# EAGLE design ZaehlerSDM72 RS485_mit Serial.swap-optimiert16102024 (EAGLE 7.5.0)
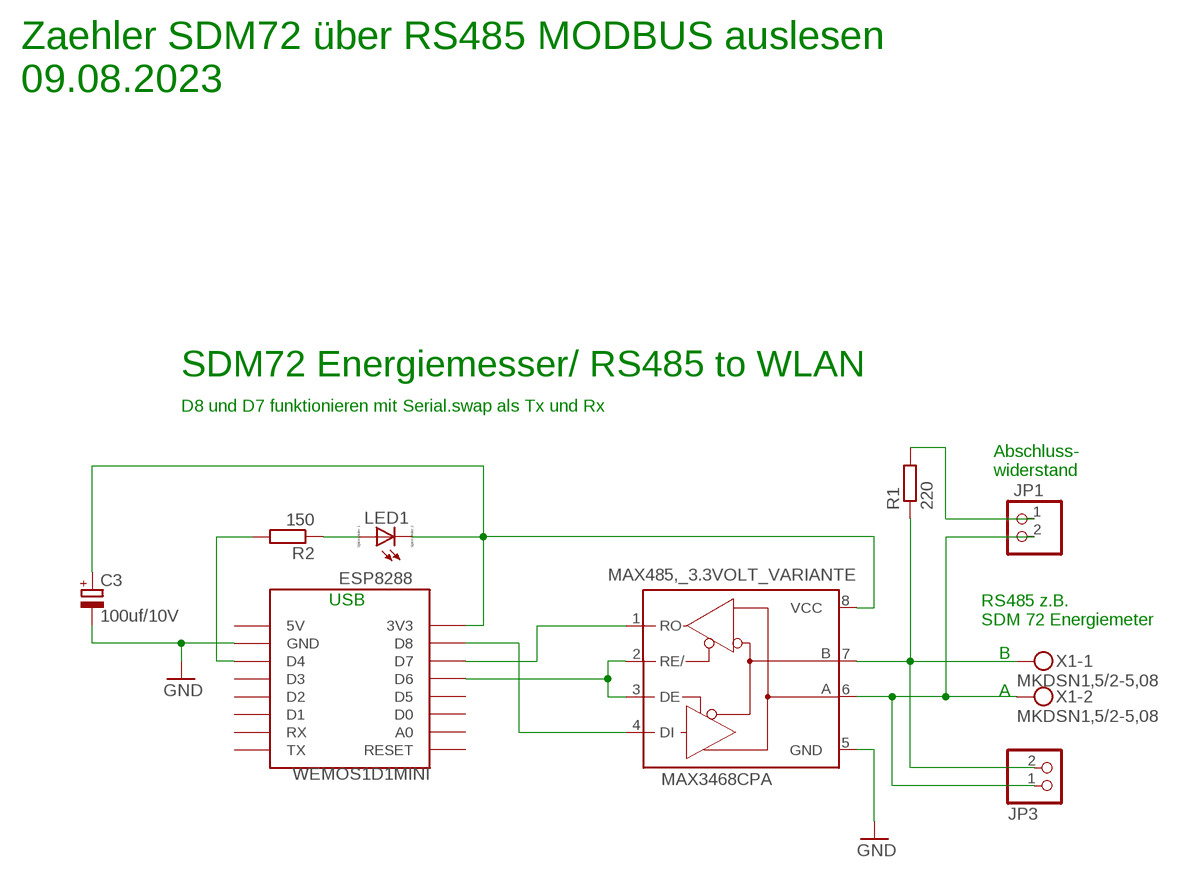
[diagram p0: schematic, sheet 1]

## Parts
C3  100uf/10V  CPOL-EUE2.5-7  [E2,5-7]
JP1  PINHD-1X2/90  [1X02/90]
JP3  PINHD-1X2/90  [1X02/90]
LED1  LED_ELD260  [LED_LD260]
MAX485,_3.3VOLT_VARIANTE  MAX3468CPA  [DIL08]
R1  220  R-EU_0207/5V  [0207/5V]
R2  150  R-EU_0207/5V  [0207/5V]
WEMOS1D1MINI  ESP8288  WEMOS-D1-MINI  [WEMOS-D1-MINI]
X1  MKDSN1,5/2-5,08  [MKDSN1,5/2-5,08]

## Nets
GND: C3.- MAX485,_3.3VOLT_VARIANTE.5(GND) WEMOS1D1MINI.GND
N$1: MAX485,_3.3VOLT_VARIANTE.2(RE/) MAX485,_3.3VOLT_VARIANTE.3(DE) WEMOS1D1MINI.D6
N$2: JP1.1 R1.2
N$3: MAX485,_3.3VOLT_VARIANTE.1(RO) WEMOS1D1MINI.D7
N$4: MAX485,_3.3VOLT_VARIANTE.4(DI) WEMOS1D1MINI.D8
N$5: R2.2 WEMOS1D1MINI.D4
N$6: LED1.A R2.1
N$7: C3.+ LED1.K(C) MAX485,_3.3VOLT_VARIANTE.8(VCC) WEMOS1D1MINI.3V3
N$21: JP3.2 MAX485,_3.3VOLT_VARIANTE.7(B) R1.1 X1.1
N$22: JP1.2 JP3.1 MAX485,_3.3VOLT_VARIANTE.6(A) X1.2
Unconnected: WEMOS1D1MINI.5V WEMOS1D1MINI.A0 WEMOS1D1MINI.D0 WEMOS1D1MINI.D1 WEMOS1D1MINI.D2 WEMOS1D1MINI.D3 WEMOS1D1MINI.D5 WEMOS1D1MINI.RESET WEMOS1D1MINI.RX WEMOS1D1MINI.TX

## Notes on the sheet
- Zaehler SDM72 über RS485 MODBUS auslesen
  09.08.2023
- SDM72 Energiemesser/ RS485 to WLAN
- D8 und D7 funktionieren mit Serial.swap als Tx und Rx
- Abschluss-
  widerstand
- USB
- RS485 z.B. 
  SDM 72 Energiemeter
- B
  
  A

## Library data of the parts
C3 = rcl:CPOL-EU: POLARIZED CAPACITOR, European symbol
JP1 JP3 = pinhead:PINHD-1X2: PIN HEADER
LED1 = eagle-ltspice:LED_E: LED Source: http://www.osram.convergy.de Source: www.luxeon.com Source: www.kingbright.com; SPICEMODEL: NONE; SPICEPREFIX: D; SPICETYPE: diode
MAX485,_3.3VOLT_VARIANTE = maxim:MAX34*: +5V, Fail-Safe, 40Mbps, Profibus RS-485/RS-422 Transceivers Source: MAX3465-MAX3469.pdf; OC_FARNELL: unknown; OC_NEWARK: unknown
R1 R2 = rcl:R-EU_: RESISTOR, European symbol
WEMOS1D1MINI = esp8266modules:WEMOS-D1-MINI: WeMos.cc D1 mini ESP8266 module
X1 = con-phoenix-508:MKDSN1,5/2-5,08: MKDSN 1,5/ 2-5,08 Printklemme Nennstrom: 13,5 A Nennspannung: 250 V Rastermaß: 5,08 mm Polzahl: 2 Anschlussart: Schraubanschluss Montage: Löten Anschlussrichtung Leiter/Platine: 0 ° Artikelnummer: 1729128 Source: http://eshop.phoenixcontact.com .. 1729128.pdf

## Board
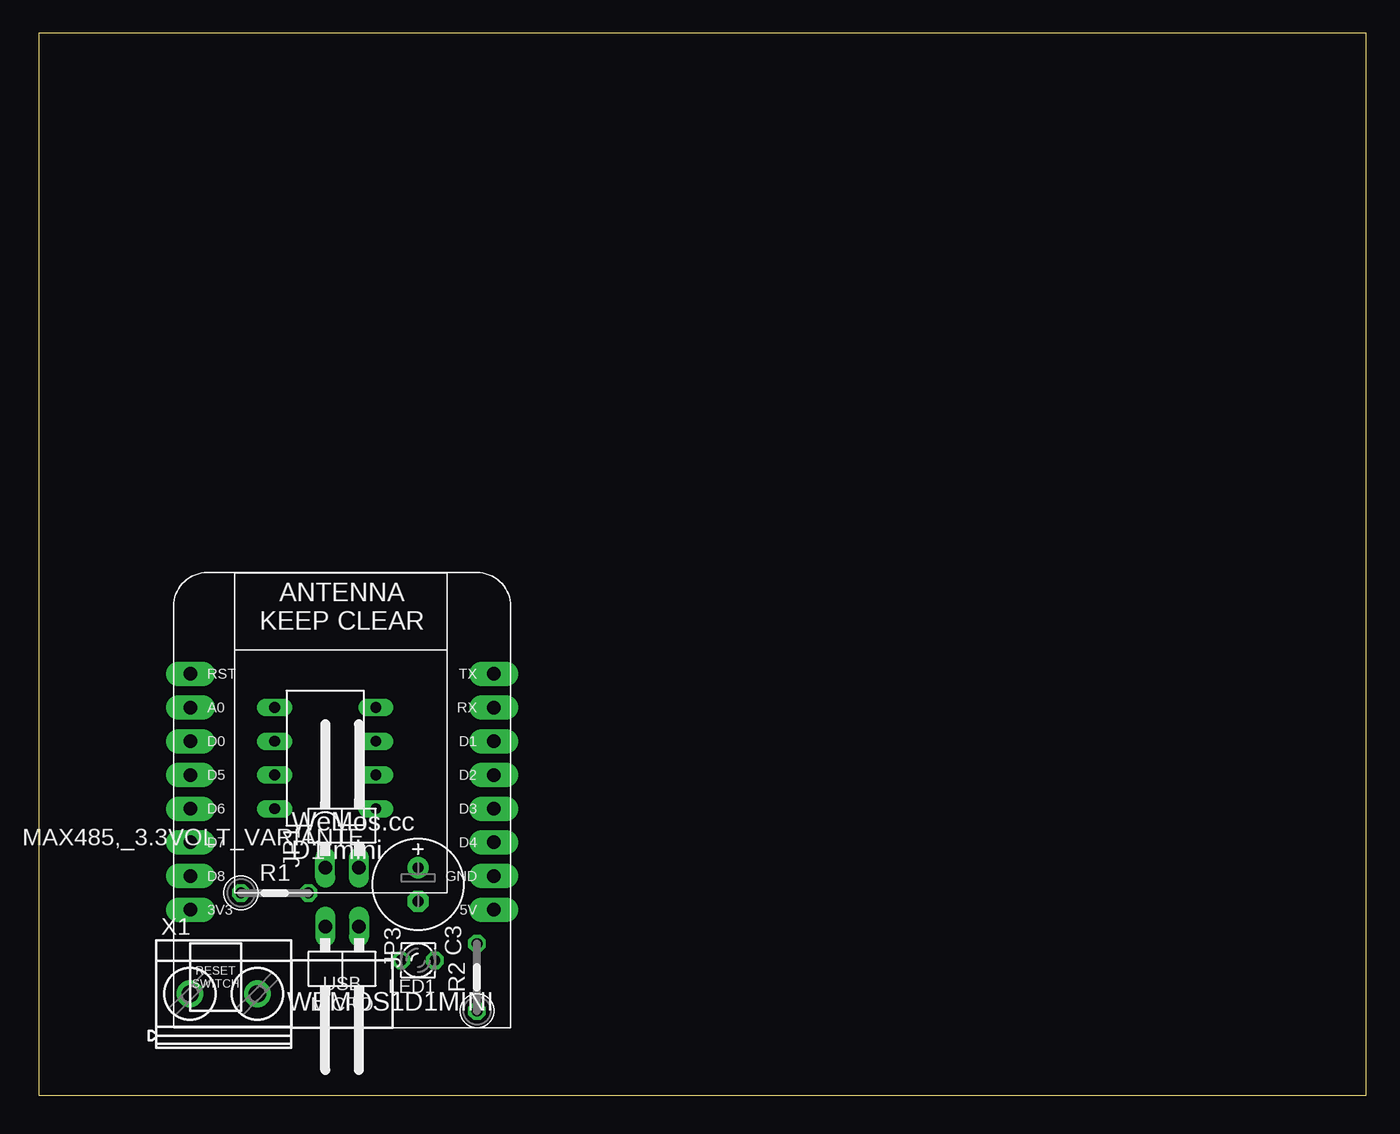
[diagram p1: board, top side]
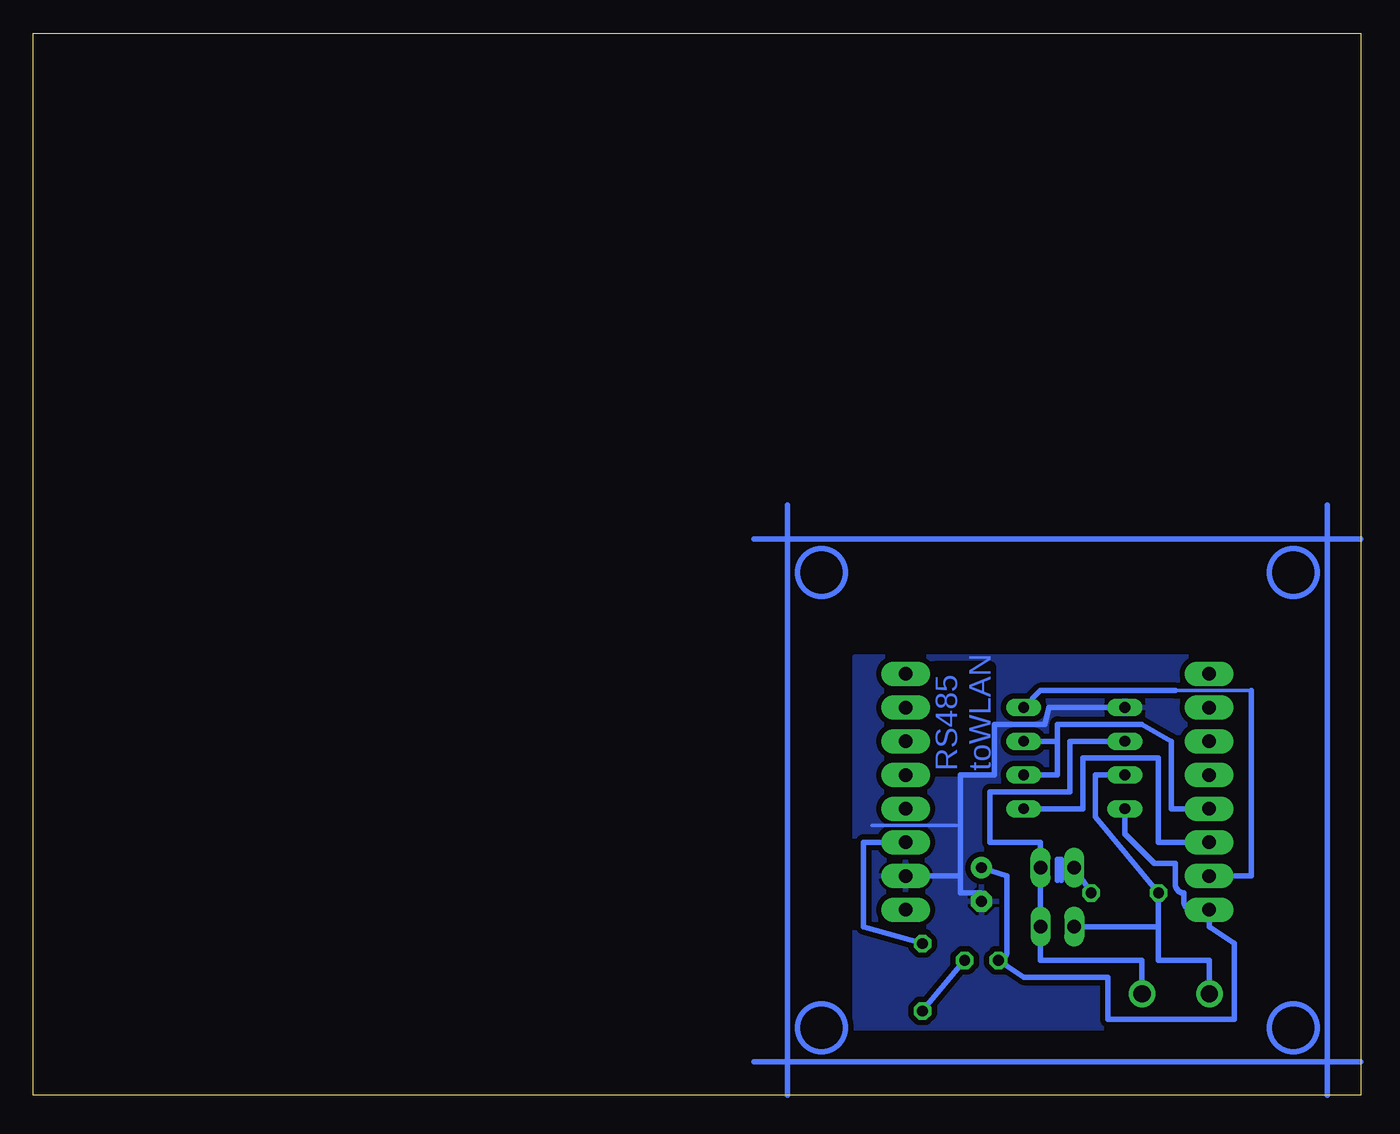
[diagram p2: board, bottom side, seen from below]

Size 100 x 80 mm. Coordinates in mm from the lower left corner, seen from the top.
Outline: 0,0 100,0 100,80 0,80 0,0
Copper layers (1*16): Top 0.035mm / dielectric 1.5mm / Bottom 0.035mm
Design rules "default": minimum track width 10mil, minimum drill 24mil, track to track 8mil, track to pad 8mil, pad to pad 8mil, via to via 8mil, smd to smd 8mil, copper to edge 40mil, drill to drill 8mil, minimum pad ring 10mil, minimum via ring 8mil, stop-mask expansion 4mil, vias tented up to drill 0mil, thermal gap 10mil

### Footprints (pad centres in the part's own frame; a part is rotated, then mirrored left to right if it is on the bottom)
E2,5-7 = drill 0.813 pad 1.6: + -1.27,0 | drill 0.813 pad 1.6 octagon: - 1.27,0
1X02/90 = drill 1.016 long: 1 -1.27,-3.81; 2 1.27,-3.81
LED_LD260 = drill 0.813 octagon: A -1.27,0; K 1.27,0
DIL08 = drill 0.813 long: 1 -3.81,-3.81; 2 -1.27,-3.81; 3 1.27,-3.81; 4 3.81,-3.81; 5 3.81,3.81; 6 1.27,3.81; 7 -1.27,3.81; 8 -3.81,3.81
0207/5V = drill 0.813 octagon: 1 -2.54,0; 2 2.54,0
WEMOS-D1-MINI = drill 1.016 pad 1.829 long: 3V3 -10.16,-10.16; 5V 12.7,-10.16; A0 -10.16,5.08; D0 -10.16,2.54; D1 12.7,2.54; D2 12.7,0; D3 12.7,-2.54; D4 12.7,-5.08; D5 -10.16,0; D6 -10.16,-2.54; D7 -10.16,-5.08; D8 -10.16,-7.62; GND 12.7,-7.62; RESET -10.16,7.62; RX 12.7,5.08; TX 12.7,7.62
MKDSN1,5/2-5,08 = drill 1.3 pad 2: 1 -2.561,0.025; 2 2.519,0.025

### Placement (x,y rotation side)
C3  28.57,15.88 270 top
JP1  22.86,20.95 0 top
JP3  22.86,8.89 180 top
LED1  28.57,10.16 180 top
MAX485,_3.3VOLT_VARIANTE  21.59,25.4 90 top
R1  17.78,15.24 0 top
R2  33.02,8.89 90 top
WEMOS1D1MINI  21.59,24.13 0 top
X1  13.97,7.62 0 top

### Tracks (layer width: path | path; a pad name or v marks a point on that pad's centre or on a via)
GND
  Bottom 0.254: 30.48,20.32 36.83,20.32
  Bottom 0.406: MAX485,_3.3VOLT_VARIANTE.5 23.5,29.21 23.81,27.94 27.62,27.94 27.62,24.13 30.16,24.13 30.16,16.51 | 30.16,16.51 30.16,15.24 28.57,15.24 C3.- | WEMOS1D1MINI.GND 30.16,16.51
  pour Bottom (isolate 0.406): 7.62,33.02 38.1,33.02 38.1,5.08 7.62,5.08
N$1
  Bottom 0.406: MAX485,_3.3VOLT_VARIANTE.2 22.86,24.13 22.86,26.67 | 22.86,26.67 22.86,27.94 16.51,27.94 14.29,26.67 14.29,21.59 WEMOS1D1MINI.D6 | MAX485,_3.3VOLT_VARIANTE.3 22.86,26.67
N$2
  Bottom 0.406: JP1.1 R1.2
N$3
  Bottom 0.406: MAX485,_3.3VOLT_VARIANTE.1 20.95,21.59 20.95,25.4 15.24,25.4 15.24,19.05 WEMOS1D1MINI.D7
N$4
  Bottom 0.254: 8.26,30.48 13.97,30.48
  Bottom 0.406: 13.97,30.48 24.13,30.48 MAX485,_3.3VOLT_VARIANTE.4 | WEMOS1D1MINI.D8 8.26,16.51 8.26,30.48
N$5
  Bottom 0.406: WEMOS1D1MINI.D4 37.47,19.05 37.47,12.7 R2.2
N$6
  Bottom 0.406: LED1.A R2.1
N$7
  Bottom 0.406: MAX485,_3.3VOLT_VARIANTE.8 17.78,19.68 15.56,17.46 13.97,17.46 13.97,15.88 arc-90 13.34,15.24 13.34,14.61 arc-90 12.7,13.97 WEMOS1D1MINI.3V3 11.43,12.7 9.53,11.43 9.53,5.71 19.05,5.71 19.05,8.89 25.4,8.89 LED1.K arc-90 26.67,10.79 26.67,16.51 C3.+
N$8
  Bottom 0.406: 0,2.54 43.18,2.54 | 43.18,2.54 45.72,2.54 | 0,41.91 2.54,41.91 | 2.54,41.91 43.18,41.91 | 43.18,41.91 45.72,41.91 | 43.18,2.54 43.18,41.91 | 2.54,0 2.54,41.91 | 43.18,0 43.18,2.54 | 2.54,44.45 2.54,41.91 | 43.18,44.45 43.18,41.91
N$9
  Bottom 0.406: 22.86,16.19 22.86,17.78 22.54,17.78 22.54,16.19
N$21
  Bottom 0.406: MAX485,_3.3VOLT_VARIANTE.7 20,24.13 20,20.95 R1.1 15.24,12.7 | X1.1 11.43,10.16 15.24,10.16 15.24,12.7 | JP3.2 15.24,12.7
N$22
  Bottom 0.406: X1.2 16.49,10.16 24.13,10.16 JP3.1 JP1.2 24.13,19.05 27.94,19.05 27.94,22.86 21.91,22.86 21.91,26.67 MAX485,_3.3VOLT_VARIANTE.6
(copper drawn outside any net)
  shapes: Bottom circle x4

### Text on the board
Bottom: RS485 / toWLAN